# Altium schematic sheet MIXR Power - Battery Charging.SchDoc: Title
size B; Organization: Midnight Sun Solar Rayce Car Team; Address1: University of Waterloo; Address2: 200 University Ave W; Address3: Waterloo, ON, Canada; Address4: N2L 3E9; DocumentNumber: 3; SheetNumber: 3; SheetTotal: 5; Website: www.uwmidsun.com; ProjectName: ProjectName
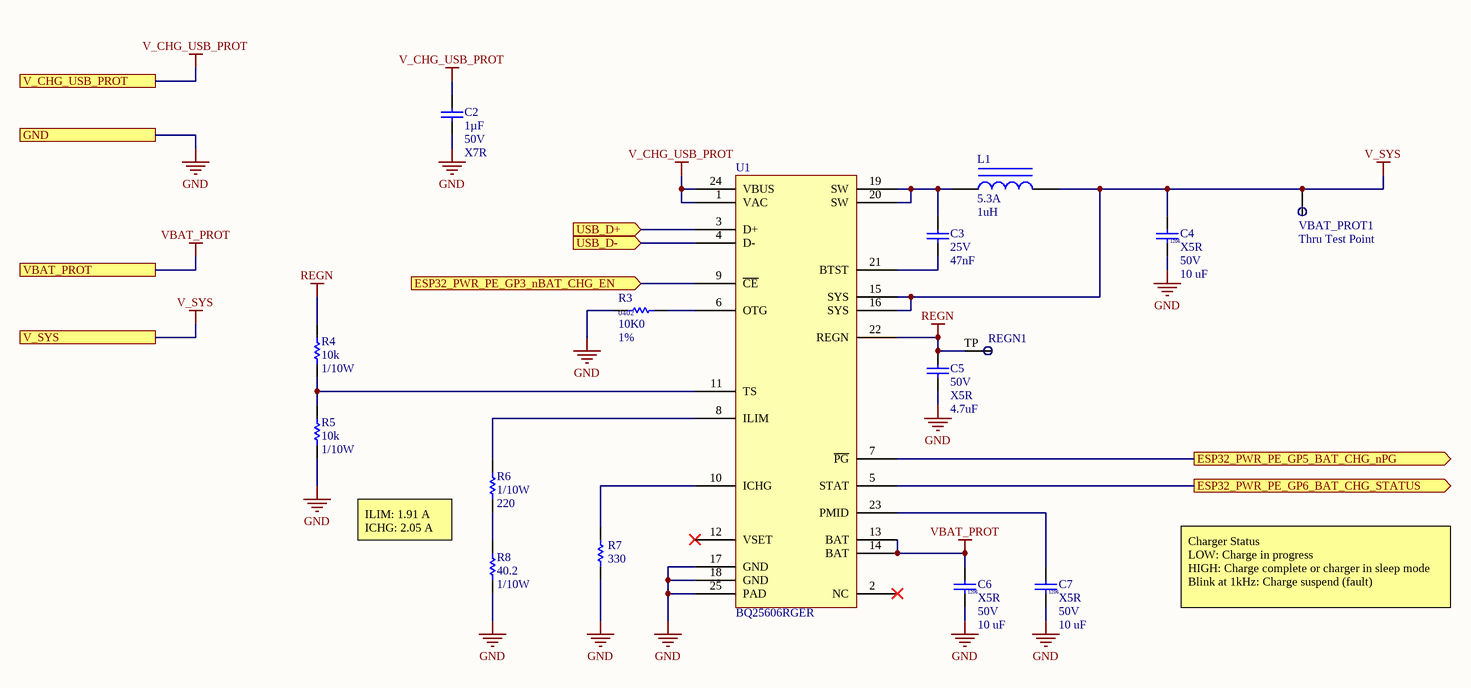
[diagram p0: MIXR Power - Battery Charging.SchDoc]

## Parts
C2  Capacitance: 1µF  Voltage: 50V  Temperature Coefficient: X7R  [CAP, 0603]  (hidden comment: CAP CER 1UF 50V 10% X7R 0603)
C3  Voltage: 25V  Capacitance: 47nF  [CAP, 0603]  (hidden comment: CAP CER 0.047UF 10% 25V X7R 0603)
C4  Rating: X5R  Voltage Rating: 50V  Capacitance: 10 uF  [CAP, 1206]  (hidden comment: CAP CER 10uF 50V 20% X5R 1206)
C5  value 4.7uF  Voltage - Rated: 50V  Temperature Coefficient: X5R  [CAP, 0805]  (hidden comment: CAP CER 4.7UF 50V 10% X5R 0805)
C6  Rating: X5R  Voltage Rating: 50V  Capacitance: 10 uF  [CAP, 1206]  (hidden comment: CAP CER 10uF 50V 20% X5R 1206)
C7  Rating: X5R  Voltage Rating: 50V  Capacitance: 10 uF  [CAP, 1206]  (hidden comment: CAP CER 10uF 50V 20% X5R 1206)
L1  Current Rating: 5.3A  Inductance: 1uH  [IND 1UH 5.3A 20 MOHM 5020]  (hidden comment: IND 1UH 5.3A 20 MOHM SMD)
R3  Resistance: 10K0  Tolerance: 1%  [RES 0402]  (hidden comment: RES 10K OHM 1% 1/16W 0402)
R4  Resistance: 10k  Power: 1/10W  [RES, 0603]  (hidden comment: RES 10K OHM 1% 1/10W 0603)
R5  Resistance: 10k  Power: 1/10W  [RES, 0603]  (hidden comment: RES 10K OHM 1% 1/10W 0603)
R6  Power (Watts): 1/10W  Resistance: 220  [RES, 0603]  (hidden comment: RES 220 OHM 1% 1/10W 0603)
R7  value 330  [RES, 0603]  (hidden comment: RES 330 OHM 1% 1/10W 0603)
R8  Resistance: 40.2  Power: 1/10W  [RES, 0603]  (hidden comment: RES 40.2 OHM 0.5% 1/10W 0603)
REGN1  Test Point  [Test Point]  (value not drawn)  (no BOM)
U1  Manufacturer Part Number: BQ25606RGER  [IC BATT CHG LI-ION 1 CELL 24-VQFN]  (hidden comment: IC BATT CHG LI-ION 1 CELL 24-VQFN)
VBAT_PROT1  Thru Test Point  [Thru Test Point]

## Ports
ESP32_PWR_PE_GP3_nBAT_CHG_EN (in), ESP32_PWR_PE_GP5_BAT_CHG_nPG (out), ESP32_PWR_PE_GP6_BAT_CHG_STATUS (out), GND, USB_D+ (in), USB_D- (in), V_CHG_USB_PROT, V_SYS, VBAT_PROT

## Nets
GND: C2.2 C4.2 C5.2 C6.2 C7.2 R3.1 R5.2 R7.2 R8.2 U1.17(GND) U1.18(GND) U1.25(PAD) ; port GND
REGN: C5.1 R4.1 REGN1.TP U1.22(REGN)
V_CHG_USB_PROT: C2.1 U1.1(VAC) U1.24(VBUS) ; port V_CHG_USB_PROT
V_SYS: C4.1 L1.2 U1.15(SYS) U1.16(SYS) VBAT_PROT1.TH_TP ; port V_SYS
VBAT_PROT: C6.1 U1.13(BAT) U1.14(BAT) ; port VBAT_PROT
ESP32_PWR_PE_GP3_nBAT_CHG_EN: U1.9(~{CE}) ; port ESP32_PWR_PE_GP3_nBAT_CHG_EN
ESP32_PWR_PE_GP5_BAT_CHG_nPG: U1.7(~{PG}) ; port ESP32_PWR_PE_GP5_BAT_CHG_nPG
ESP32_PWR_PE_GP6_BAT_CHG_STATUS: U1.5(STAT) ; port ESP32_PWR_PE_GP6_BAT_CHG_STATUS
USB_D+: U1.3(D+) ; port USB_D+
USB_D-: U1.4(D-) ; port USB_D-
NetC3_1: C3.1 L1.1 U1.19(SW) U1.20(SW)
NetC3_2: C3.2 U1.21(BTST)
NetC7_1: C7.1 U1.23(PMID)
NetR3_2: R3.2 U1.6(OTG)
NetR4_2: R4.2 R5.1 U1.11(TS)
NetR6_1: R6.1 U1.8(ILIM)
NetR6_2: R6.2 R8.1
NetR7_1: R7.1 U1.10(ICHG)

Not connected (* = marked no-connect by the designer): U1 2(NC)* 12(VSET)*

## Notes on the sheet
- ILIM: 1.91 A
  ICHG: 2.05 A
- Charger Status
  LOW: Charge in progress
  HIGH: Charge complete or charger in sleep mode
  Blink at 1kHz: Charge suspend (fault)
- PROJECT
- DOCUMENT
- DRAWN BY
- LAST MODIFIED
- PART NUMBER
- REVISION
- SHEET
- VARIANT
- OF

## Library data of the parts
C2 = CAP CER 1UF 50V 10% X7R 0603: 1µF ±10% 50V Ceramic Capacitor X7R 0603 (1608 Metric); Manufacturer 1: Taiyo Yuden; Manufacturer Part Number 1: UMK107AB7105KA-T; Supplier 1: Digi-Key; Supplier Part Number 1: 587-3247-1-ND; Packaging: Cut Tape (CT); Part Status: Active; Operating Temperature: -55°C ~ 125°C; Ratings: -; Mounting Type: Surface Mount, MLCC; Package / Case: 0603 (1608 Metric); Size / Dimension: 0.063" L x 0.031" W (1.60mm x 0.80mm); Height - Seated (Max): -; Thickness (Max): 0.037" (0.95mm); Lead Spacing: -; Lead Style: -; ComponentLink1URL: http://www.yuden.co.jp/productdata/catalog/en/mlcc_all_e.pdf; ComponentLink1Description: http://www.yuden.co.jp/productdata/catalog/en/mlcc_all_e.pdf; Tolerance: ±10%
C3 = CAP CER 0.047UF 10% 25V X7R 0603: 0.047µF ±10% 25V Ceramic Capacitor X7R 0603 (1608 Metric) /; Manufacturer: KEMET; Manufacturer Part Number: C0603C473K3RACTU; Supplier 1: Digi-Key; Supplier Part Number 1: 399-7931-1-ND; Stock 1: 1163581; Pricing 1: 1 = 0.11000, 10 = 0.07800, 100 = 0.03650, 500 = 0.02562, 1000 = 0.02121 (USD); RoHS: Yes; Mount: Surface Mount; Case/Package: 0603; Dielectric Material: Ceramic; Contact Plating: Tin; Min Operating Temperature: -55°C; Max Operating Temperature: 125°C; Tolerance: 10%; Packaging: Tape and Reel; Dielectric: X7R; Termination: SMD/SMT; Voltage Rating (DC): 25V; Length: 1.6mm; Height: 0.8mm; Depth: 0.8mm; Radiation Hardening: No; ComponentLink1URL: https://datasheet.ciiva.com/28682/1851736-28682293.pdf?src-supplier=Element14; ComponentLink1Description: https://datasheet.ciiva.com/28682/1851736-28682293.pdf?src-supplier=Element14; ComponentLink2URL: https://datasheet.ciiva.com/28584/1918693-28584138.pdf?src-supplier=Element14; ComponentLink2Description: https://datasheet.ciiva.com/28584/1918693-28584138.pdf?src-supplier=Element14; ComponentLink3URL: https://datasheet.ciiva.com/46445/1851736-46445227.pdf?src-supplier=Element14; ComponentLink3Description: https://datasheet.ciiva.com/46445/1851736-46445227.pdf?src-supplier=Element14; ComponentLink4URL: https://datasheet.ciiva.com/18193/getdatasheetpartid-330260-18193100.pdf?src-supplier=Verical; ComponentLink4Description: https://datasheet.ciiva.com/18193/getdatasheetpartid-330260-18193100.pdf?src-supplier=Verical; ComponentLink5URL: https://datasheet.ciiva.com/7824/kem-c1002-x7r-smd-7824045.pdf?src-supplier=Element14; ComponentLink5Description: https://datasheet.ciiva.com/7824/kem-c1002-x7r-smd-7824045.pdf?src-supplier=Element14
C4 C6 C7 = CAP CER 10uF 50V 20% X5R 1206: 10µF ±20% 50V Ceramic Capacitor X5R 1206 (3216 Metric) /; Manufacturer: Murata; Manufacturer Part Number: GRT31CR61H106ME01L; Supplier 1: Digi-Key; Supplier Part Number 1: 490-12457-1-ND; RoHS: Yes; Stock 1: 449467; Pricing 1: 1 = 0.57000, 10 = 0.39800, 100 = 0.23910, 500 = 0.17930, 1000 = 0.15141 (USD); Mount: Surface Mount; Case/Package: 1206; Case Code (Metric): 3216; Case Code (Imperial): 1206; Min Operating Temperature: -55°C; Max Operating Temperature: 85°C; Packaging: Tape and Reel; Tolerance: 20%; Length: 0.126inch; Width: 0.063inch; Thickness: 0.071inch; Ratings: AEC-Q200
C5 = CAP CER 4.7UF 50V 10% X5R 0805: 4.7µF ±20% 50V Ceramic Capacitor X5R 0805 (2012 Metric); Manufacturer 1: Murata Electronics North America; Manufacturer Part Number 1: GRT21BR61H475ME13L; Description 1: CAP CER 4.7UF 50V X5R 0805; Supplier 1: Digi-Key; Supplier Part Number 1: 490-12395-1-ND; RoHS: RoHS Compliant; Category: Capacitors; Stock 1: 4286; Pricing 1: 1=0.56, 10=0.389, 100=0.2338, 500=0.17536, 1000=0.14808 (CAD); Packaging: Cut Tape (CT); Part Status: Active; Tolerance: ±20%; Operating Temperature: -55°C ~ 85°C; Features: -; Ratings: AEC-Q200; Applications: Automotive; Mounting Type: Surface Mount, MLCC; Package / Case: 0805 (2012 Metric); Size / Dimension: 0.079" L x 0.049" W (2.00mm x 1.25mm); Height - Seated (Max): -; Thickness (Max): 0.057" (1.45mm); Lead Spacing: -; Lead Style: -; ComponentLink1URL: http://search.murata.co.jp/Ceramy/image/img/A01X/G101/ENG/GRT21BR61H475ME13-01.pdf; ComponentLink1Description: http://search.murata.co.jp/Ceramy/image/img/A01X/G101/ENG/GRT21BR61H475ME13-01.pdf
L1 = IND 1UH 5.3A 20 MOHM SMD: WURTH ELEKTRONIK         74437334010             Surface Mount Power Inductor, WE-LHMI Series, 1 H, 5.3 A, 13.9 A, Shielded, 0.02 ohm; Manufacturer: Wurth Electronics; Core Material: Ferrite; Saturation Current: 13.9A; DC Resistance (DCR): 20mR; Self Resonant Frequency: 65MHz; Test Frequency: 100kHz; Tolerance: 20%; Supplier 1: Digi-Key; Manufacturer Part Number: 74437334010; RoHS: Yes; Category: Fixed Inductors; Stock 1: 2869; Pricing 1: 1=2.39000, 50=2.21400, 100=2.01300, 250=1.83000, 500=1.66300 (USD); Mount: Surface Mount; Case/Package: SMD/SMT; Number of Pins: 2; Min Operating Temperature: -40°C; Max Operating Temperature: 125°C; Packaging: Cut Tape; Composition: Wirewound; Shielding: Shielded; RMS Current (Irms): 5.3A; Inductance Tolerance: 20%; Length: 0.205inch; Width: 0.205inch; Height - Seated (Max): 0.079inch; REACH SVHC: Unknown; ComponentLink1URL: http://www.farnell.com/datasheets/1880894.pdf?src-supplier=Farnell; ComponentLink1Description: http://www.farnell.com/datasheets/1880894.pdf?src-supplier=Farnell; ComponentLink2URL: http://www.farnell.com/datasheets/1880894.pdf?src-supplier=Element14; ComponentLink2Description: http://www.farnell.com/datasheets/1880894.pdf?src-supplier=Element14; Supplier Part Number 1: 732-6149-1-ND
R3 = RES 10K OHM 1% 1/16W 0402: Surface Mount Thick Film Resistor, Rc Series, 10 Kohm, 62.5 Mw, - 1%, 50 V, 0402 [1005 Metric]; Manufacturer: Yageo; Manufacturer Part Number: RC0402FR-0710KL; Temperature Coefficient: 100ppm/°C; Voltage Rating: 50V; Power Rating: 62.5mW; Supplier 1: Digi-Key; RoHS: Yes; Category: Chip SMD Resistors; Stock 1: 60761136; Pricing 1: 1=0.10000, 10=0.01600, 100=0.00640, 1000=0.00289, 2500=0.00251, 5000=0.00207 (USD); Case/Package: 0402; Number of Pins: 2; Case Code (Imperial): 0402; Case Code (Metric): 1005; Min Operating Temperature: -55°C; Max Operating Temperature: 155°C; Packaging: Tape and Reel; Composition: Thick Film; Voltage Rating (DC): 50V; Termination: SMD/SMT; Military Standard: Not; Working Voltage: 50V; Number of Terminations: 2; Length: 1mm; Height: 0.32mm; Width: 0.5mm; Depth: 0.5mm; Lead Pitch: 0.2mm; REACH SVHC: No SVHC; Lead Free: Lead Free; ComponentLink1URL: https://datasheet.ciiva.com/7660/38568-7660787.pdf?src-supplier=Element14; ComponentLink1Description: https://datasheet.ciiva.com/7660/38568-7660787.pdf?src-supplier=Element14; ComponentLink2URL: https://datasheet.ciiva.com/7983/1018594-7983486.pdf?src-supplier=Element14; ComponentLink2Description: https://datasheet.ciiva.com/7983/1018594-7983486.pdf?src-supplier=Element14; ComponentLink3URL: https://datasheet.ciiva.com/7849/1784430-7849813.pdf?src-supplier=Element14; ComponentLink3Description: https://datasheet.ciiva.com/7849/1784430-7849813.pdf?src-supplier=Element14; ComponentLink4URL: https://datasheet.ciiva.com/7849/1686128-7849814.pdf?src-supplier=Element14; ComponentLink4Description: https://datasheet.ciiva.com/7849/1686128-7849814.pdf?src-supplier=Element14; ComponentLink5URL: https://datasheet.ciiva.com/7849/1784430-7849815.pdf?src-supplier=Element14; ComponentLink5Description: https://datasheet.ciiva.com/7849/1784430-7849815.pdf?src-supplier=Element14; ComponentLink6URL: https://datasheet.ciiva.com/22747/1018594-22747512.pdf?src-supplier=Element14; ComponentLink6Description: https://datasheet.ciiva.com/22747/1018594-22747512.pdf?src-supplier=Element14; ComponentLink7URL: https://datasheet.ciiva.com/12667/pyu-rc0402-51-rohs-l-6-r-12667067.pdf?src-supplier=Mouser; ComponentLink7Description: https://datasheet.ciiva.com/12667/pyu-rc0402-51-rohs-l-6-r-12667067.pdf?src-supplier=Mouser; Supplier Part Number 1: 311-10.0KLRCT-ND
R4 R5 = RES 10K OHM 1% 1/10W 0603: RES SMD 10K OHM 1% 1/10W 0603; Manufacturer 1: Yageo; Manufacturer Part Number 1: RC0603FR-0710KL; Temperature Coefficient: ±100ppm/°C; Supplier 1: Digi-Key; Supplier Part Number 1: 311-10.0KHRCT-ND; Packaging: Cut Tape (CT); Part Status: Active; Composition: Thick Film; Operating Temperature: -55°C ~ 155°C; Package / Case: 0603 (1608 Metric); Supplier Device Package: 0603; Size / Dimension: 0.063" L x 0.031" W (1.60mm x 0.80mm); Height - Seated (Max): 0.022" (0.55mm); Failure Rate: -; ComponentLink1URL: http://www.yageo.com/documents/recent/PYu-RC_Group_51_RoHS_L_7.pdf; ComponentLink1Description: http://www.yageo.com/documents/recent/PYu-RC_Group_51_RoHS_L_7.pdf; Tolerance: ±1%
R6 = RES 220 OHM 1% 1/10W 0603: 220 Ohms ±1% 0.1W, 1/10W Chip Resistor 0603 (1608 Metric) Moisture Resistant Thick Film; Manufacturer: Yageo; Manufacturer Part Number: RC0603FR-07220RL; Temperature Coefficient: ±100ppm/°C; Supplier 1: Digi-Key; RoHS: RoHS Compliant; Category: Resistors; Stock 1: 1318812; Pricing 1: 1=0.15, 10=0.022, 100=0.0088, 1000=0.00392, 2500=0.0034 (CAD); Packaging: Cut Tape (CT); Part Status: Active; Tolerance: ±1%; Composition: Thick Film; Features: Moisture Resistant; Operating Temperature: -55°C ~ 155°C; Package / Case: 0603 (1608 Metric); Supplier Device Package: 0603; Size / Dimension: 0.063" L x 0.032" W (1.60mm x 0.80mm); Height - Seated (Max): 0.022" (0.55mm); Failure Rate: -; ComponentLink1URL: http://www.yageo.com/documents/recent/PYu-RC_Group_51_RoHS_L_8.pdf; ComponentLink1Description: http://www.yageo.com/documents/recent/PYu-RC_Group_51_RoHS_L_8.pdf; Supplier Part Number 1: 311-220HRCT-ND
R7 = RES 330 OHM 1% 1/10W 0603: 330 Ohms ±1% 0.1W, 1/10W Chip Resistor 0603 (1608 Metric) Automotive AEC-Q200, Moisture Resistant Thick Film; Manufacturer: TE Connectivity; Manufacturer Part Number: CRGCQ0603F330R; Supplier 1: Digi-Key; Supplier Part Number 1: A129682CT-ND; RoHS: No; Stock 1: 87700; Pricing 1: 1 = 0.10000, 10 = 0.03300, 100 = 0.01320, 1000 = 0.00595, 2500 = 0.00516 (USD); ComponentLink1URL: http://www.te.com/commerce/DocumentDelivery/DDEController?Action=srchrtrv&DocNm=1773204-3&DocType=DS&DocLang=English&src-supplier=Digi-Key; ComponentLink1Description: http://www.te.com/commerce/DocumentDelivery/DDEController?Action=srchrtrv&DocNm=1773204-3&DocType=DS&DocLang=English&src-supplier=Digi-Key; ComponentLink2URL: https://www.te.com/commerce/DocumentDelivery/DDEController?Action=srchrtrv&DocNm=1773204-3&DocType=DS&DocLang=English&src-supplier=Digi-Key; ComponentLink2Description: https://www.te.com/commerce/DocumentDelivery/DDEController?Action=srchrtrv&DocNm=1773204-3&DocType=DS&DocLang=English&src-supplier=Digi-Key
R8 = RES 40.2 OHM 0.5% 1/10W 0603: RES SMD 40.2 OHM 0.5% 1/10W 0603; Manufacturer 1: Yageo; Manufacturer Part Number 1: RT0603DRE0740R2L; Temperature Coefficient: ±50ppm/°C; Supplier 1: Digi-Key; Supplier Part Number 1: 311-2576-1-ND; Packaging: Cut Tape (CT); Part Status: Active; Composition: Thin Film; Operating Temperature: -55°C ~ 155°C; Package / Case: 0603 (1608 Metric); Supplier Device Package: 0603; Size / Dimension: 0.063" L x 0.031" W (1.60mm x 0.80mm); Height - Seated (Max): 0.022" (0.55mm); Failure Rate: -; ComponentLink1URL: http://www.yageo.com/documents/recent/PYu-RT_1-to-0.01_RoHS_L_7.pdf; ComponentLink1Description: http://www.yageo.com/documents/recent/PYu-RT_1-to-0.01_RoHS_L_7.pdf; Tolerance: ±0.5%
U1 = IC BATT CHG LI-ION 1 CELL 24-VQFN: Charger IC Lithium Ion/Polymer 24-VQFN (4x4); Manufacturer: Texas Instruments; Number of Cells: 1; Supplier 1: Digi-Key; Supplier Part Number 1: 296-47743-1-ND; Stock 1: 8983; Pricing 1: 1 = 2.76000, 10 = 2.48100, 100 = 2.03260, 500 = 1.73032, 1000 = 1.45930 (USD); RoHS: No; ComponentLink1URL: http://www.ti.com/lit/ds/symlink/bq25606.pdf?src-supplier=Digi-Key; ComponentLink1Description: http://www.ti.com/lit/ds/symlink/bq25606.pdf?src-supplier=Digi-Key